# Altium schematic sheet BigBoard.SchDoc
size A
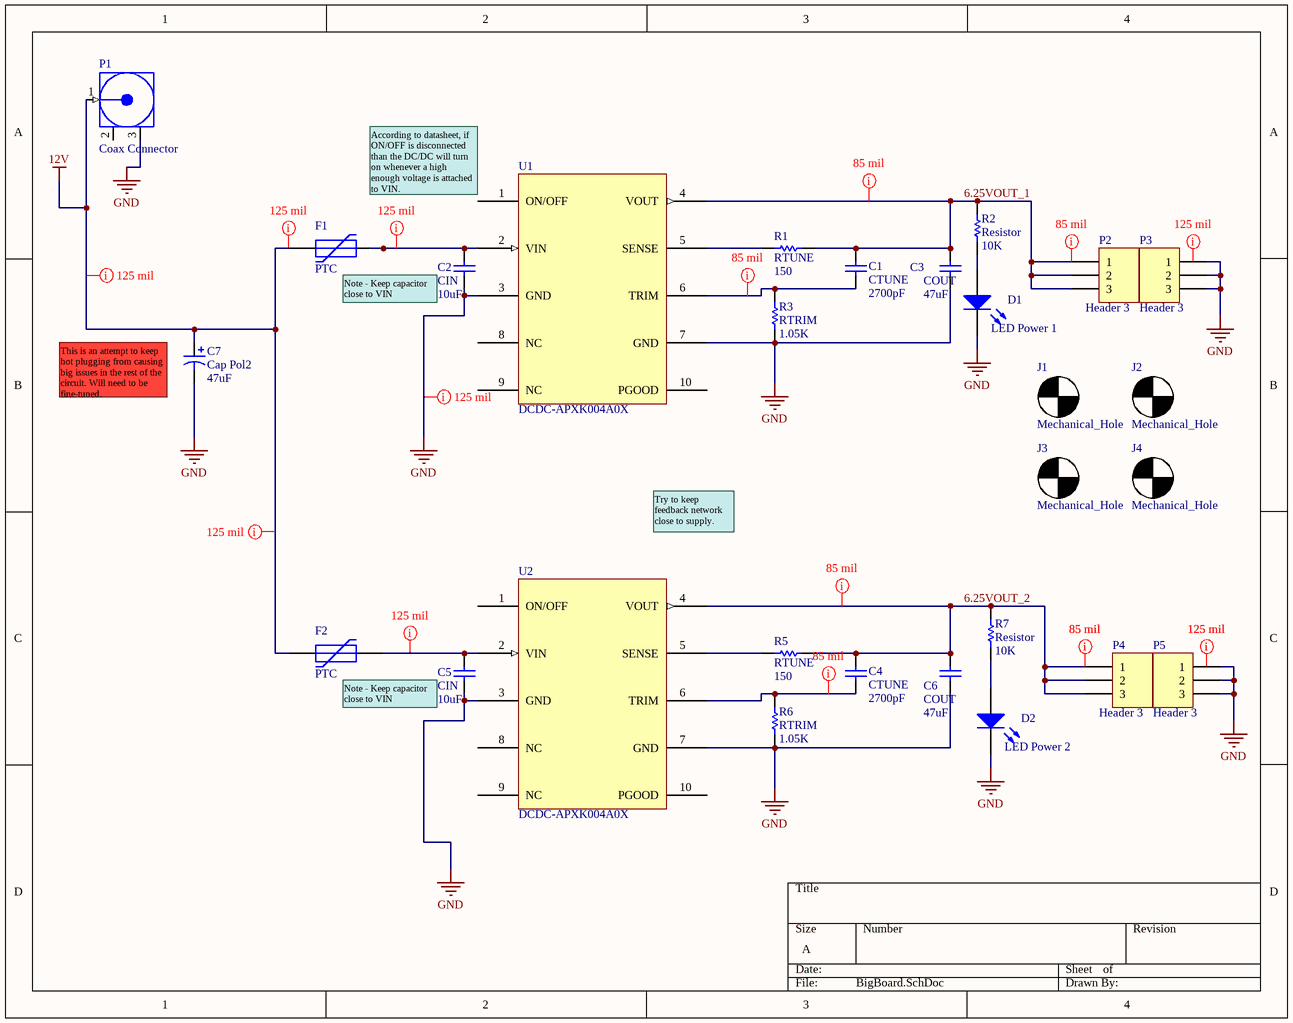
[diagram p0: BigBoard.SchDoc]

## Parts
C1  CTUNE  value 2700pF  [CAPC1608L]
C2  CIN  value 10uF  [CAPC2012L]
C3  COUT  value 47uF  [CAPC3216L]
C4  CTUNE  value 2700pF  [CAPC1608L]
C5  CIN  value 10uF  [CAPC2012L]
C6  COUT  value 47uF  [CAPC3216L]
C7  Cap Pol2  value 47uF  [RAD-POLAR-0.1]
D1  LED Power 1  [SurfaceMount(603)]
D2  LED Power 2  [SurfaceMount(603)]
F1  PTC  [J1-1812]
F2  PTC  [J1-1812]
J1  Mechanical_Hole  [#4_Screw_Hole]
J2  Mechanical_Hole  [#4_Screw_Hole]
J3  Mechanical_Hole  [#4_Screw_Hole]
J4  Mechanical_Hole  [#4_Screw_Hole]
P1  Coax Connector  [COAX_3pin]
P2  Header 3  [Euroblock-A98334]
P3  Header 3  [Euroblock-A98334]
P4  Header 3  [Euroblock-A98334]
P5  Header 3  [Euroblock-A98334]
R1  RTUNE  value 150  [J1-0603]
R2  Resistor  value 10K  [J1-0603]
R3  RTRIM  value 1.05K  [J1-0603]
R5  RTUNE  value 150  [J1-0603]
R6  RTRIM  value 1.05K  [J1-0603]
R7  Resistor  value 10K  [J1-0603]
U1  DCDC-APXK004A0X  [DCDC-APXK004A0X]
U2  DCDC-APXK004A0X  [DCDC-APXK004A0X]

## Nets
12V: C7.1 F1.1 F2.1 P1.1(VCC)
GND: C2.1 C3.1 C5.1 C6.1 C7.2 D1.2(K) D2.2(K) P1.3(GND) P3.1 P3.2 P3.3 P5.1 P5.2 P5.3 R3.1 R6.1 U1.3(GND) U1.7(GND) U2.3(GND) U2.7(GND)
6.25VOUT_1: C1.1 C3.2 P2.1 P2.2 P2.3 R1.1 R2.1 U1.4(VOUT)
6.25VOUT_2: C4.1 C6.2 P4.1 P4.2 P4.3 R5.1 R7.1 U2.4(VOUT)
NetC1_2: C1.2 R3.2 U1.6(TRIM)
NetC2_2: C2.2 F1.2 U1.2(VIN)
NetC4_2: C4.2 R6.2 U2.6(TRIM)
NetC5_2: C5.2 F2.2 U2.2(VIN)
NetD1_1: D1.1(A) R2.2
NetD2_1: D2.1(A) R7.2
NetR1_2: R1.2 U1.5(SENSE)
NetR5_2: R5.2 U2.5(SENSE)

Not connected (* = marked no-connect by the designer): P1 2; U1 1(ON/OFF) 8(NC) 9(NC) 10(PGOOD); U2 1(ON/OFF) 8(NC) 9(NC) 10(PGOOD)

## Layout directives
rule Width Constraint [Pref Width = 125mil    Min Width = 50mil    Max Width = 200mil]: 12V, (no net found under the mark), GND, NetC2_2, NetC5_2
rule Width Constraint [Pref Width = 85mil    Min Width = 20mil    Max Width = 120mil]: 6.25VOUT_1, 6.25VOUT_2, NetC1_2, NetC4_2

## Notes on the sheet
- According to datasheet, if ON/OFF is disconnected than the DC/DC will turn on whenever a high enough voltage is attached to VIN.
- Note - Keep capacitor close to VIN
- (near C7) This is an attempt to keep hot plugging from causing big issues in the rest of the circuit. Will need to be fine-tuned.
- Try to keep feedback network close to supply.

## Library data of the parts
C1-C6 = Cap: Capacitor; Published: 8-Jun-2000; LatestRevisionDate: 17-Jul-2002; LatestRevisionNote: Re-released for DXP Platform.; PackageReference: RAD-0.3; Publisher: Altium Limited
C7 = Cap Pol2: Polarized Capacitor (Axial); Published: 8-Jun-2000; LatestRevisionDate: 17-Jul-2002; LatestRevisionNote: Re-released for DXP Platform.; PackageReference: POLAR0.8; Publisher: Altium Limited
D1 D2 = LED
F1 F2 = PTC_FUSE: Fuse; Published: 8-Jun-2000; LatestRevisionDate: 17-Jul-2002; LatestRevisionNote: Re-released for DXP Platform.; PackageReference: PIN-W2/E2.8; Publisher: Altium Limited
J1-J4 = Mechanical_Hole: A mechanical hole for mounting the board
P1 = COAX-M-3pin
P2-P5 = Header 3: Header, 3-Pin; LatestRevisionDate: 17-Jul-2002; LatestRevisionNote: Re-released for DXP Platform.; Publisher: Altium Limited
R1 R3 R5 R6 = Resistor: Published: 8-Jun-2000; LatestRevisionDate: 17-Jul-2002; LatestRevisionNote: Re-released for DXP Platform.; PackageReference: AXIAL-0.3; Publisher: Altium Limited; PackageDescription: Axial Device, Thru-Hole; 2 Leads; 0.3 in Pin Spacing
U1 U2 = DCDC-APXK004A0X: DC/DC converter for the rone charger
R2 R7 = Resistor: Published: 8-Jun-2000; LatestRevisionDate: 17-Jul-2002; LatestRevisionNote: Re-released for DXP Platform.; PackageReference: AXIAL-0.3; Publisher: Altium Limited; PackageDescription: Axial Device, Thru-Hole; 2 Leads; 0.3 in Pin Spacing